# EAGLE schematic KT-744 (EAGLE 6.4)
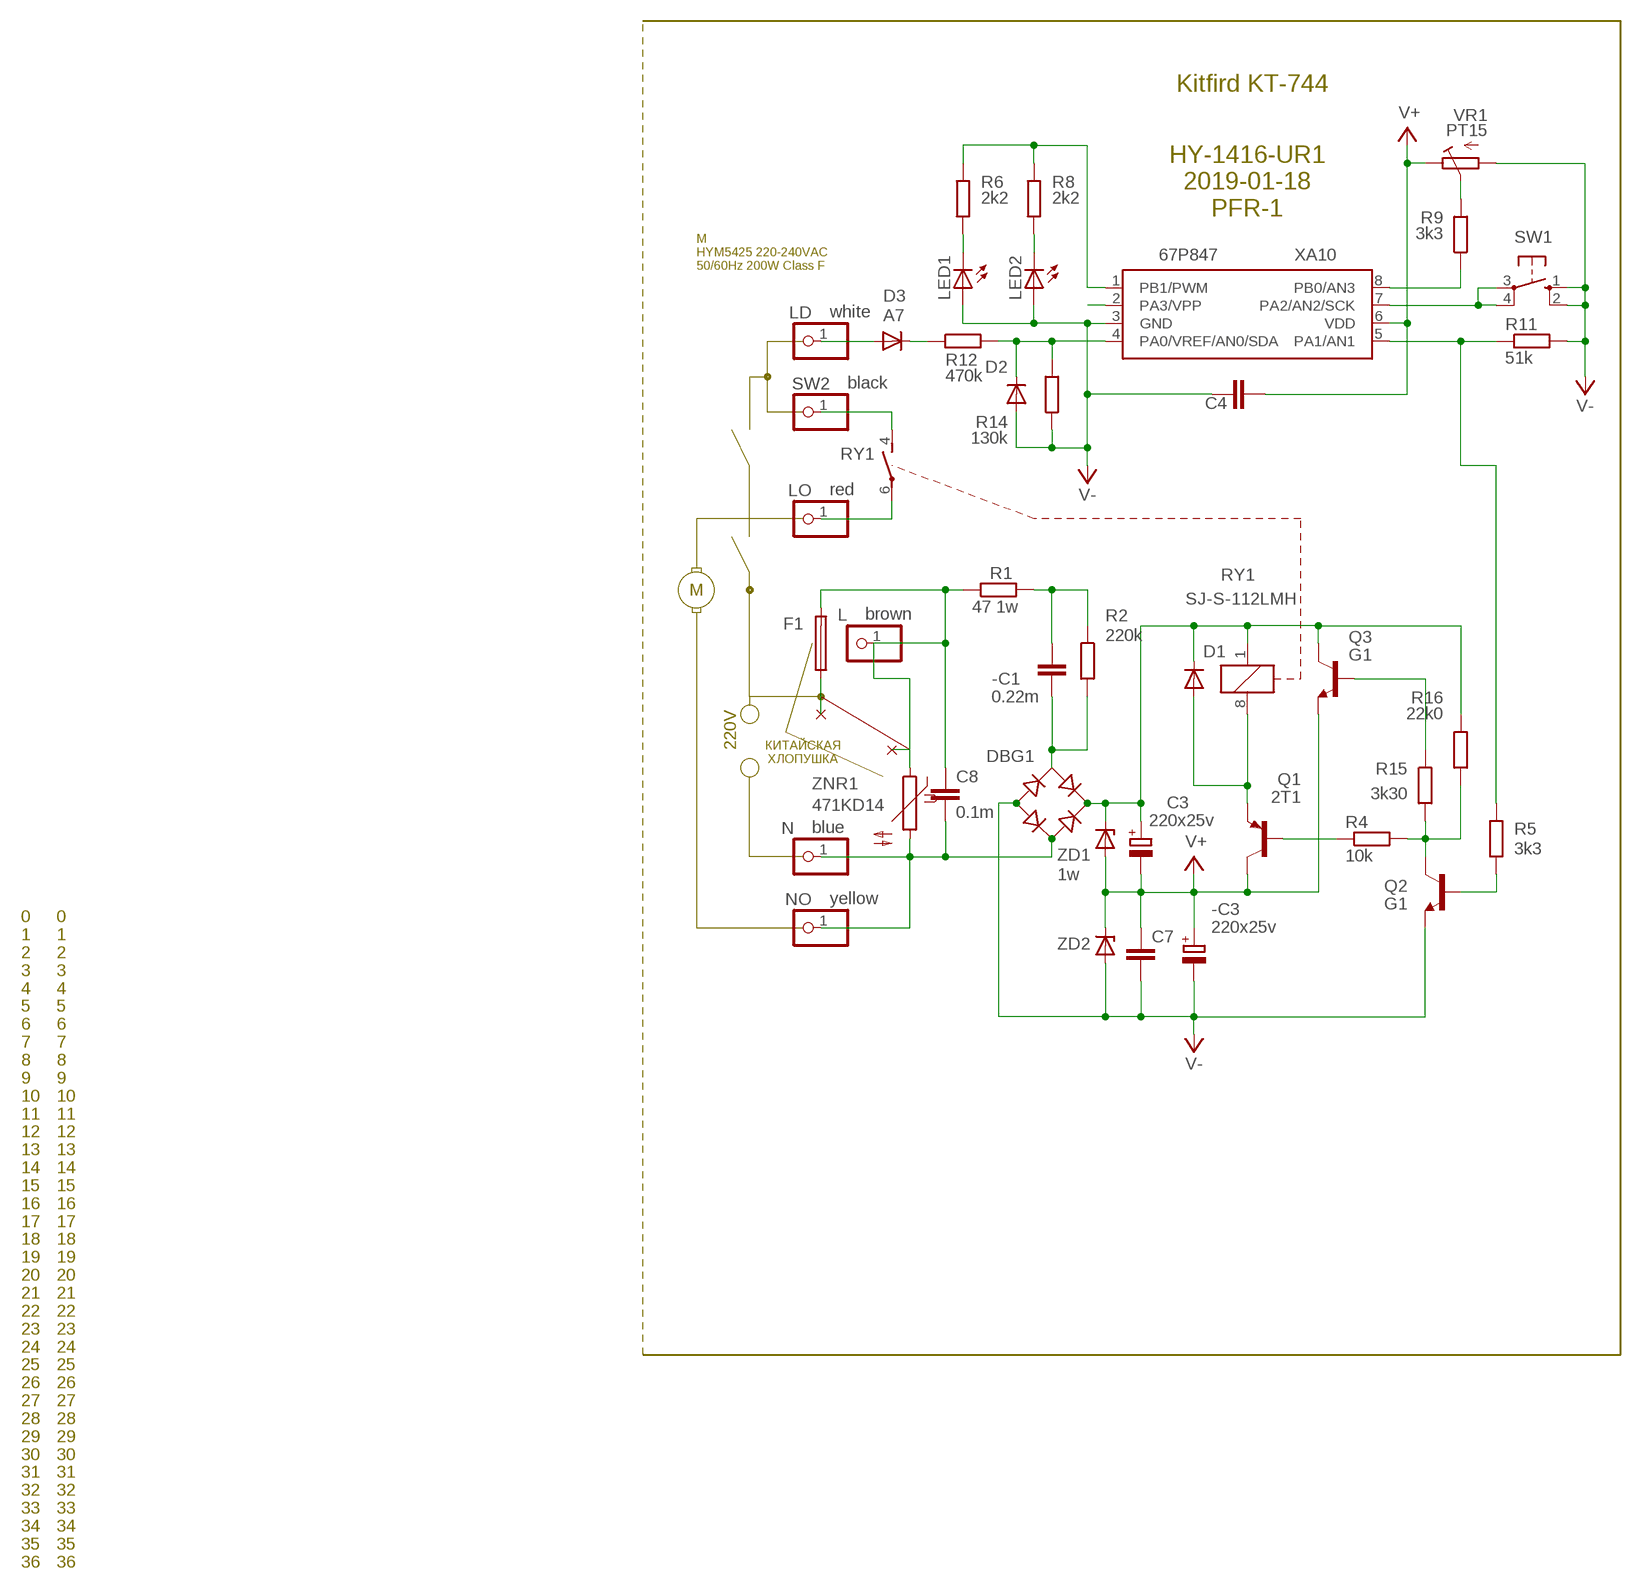
[diagram p0: schematic, sheet 1]

## Parts
67P847  XA10  SH67P847  [SOIC8]
-C1  0.22m  C-EU150-072X183  [C150-072X183]
-C3  220x25v  CPOL-EUE5-10.5  [E5-10,5]
C3  220x25v  CPOL-EUE5-10.5  [E5-10,5]
C4  C-EU150-072X183  [C150-072X183]
C7  C-EU150-072X183  [C150-072X183]
C8  0.1m  C-EU102-064X133  [C102-064X133]
D1  DIODE-SOD80C  [SOD80C]
D2  DIODE-SOD80C  [SOD80C]
D3  A7  DIODE-SOD80C  [SOD80C]
DBG1  B1S  [MBS]
F1  PICOFUSE  [PICOFUSE]
L  brown  PINHD-1X1  [1X01]
LD  white  PINHD-1X1  [1X01]
LED1  LEDSML0805  [SML0805]
LED2  LEDSML0805  [SML0805]
LO  red  PINHD-1X1  [1X01]
N  blue  PINHD-1X1  [1X01]
NO  yellow  PINHD-1X1  [1X01]
Q1  2T1  -PNP-SOT23-EBC  [SOT23-EBC]
Q2  G1  -NPN-SOT23-EBC  [SOT23-EBC]
Q3  G1  -NPN-SOT23-EBC  [SOT23-EBC]
R1  47 1w  R-EU_0414/15  [0414/15]
R2  220k  R-EU_0207/12  [0207/12]
R4  10k  R-EU_M1206  [M1206]
R5  3k3  R-EU_M0805  [M0805]
R6  2k2  R-EU_0207/12  [0207/12]
R8  2k2  R-EU_0207/12  [0207/12]
R9  3k3  R-EU_M0805  [M0805]
R11  51k  R-EU_M0805  [M0805]
R12  470k  R-EU_0207/15  [0207/15]
R14  130k  R-EU_M0805  [M0805]
R15  3k30  R-EU_M1206  [M1206]
R16  22k0  R-EU_M0805  [M0805]
RY1  SJ-S-112LMH  JW1A  [JW1A]
SW1  10-XX  [B3F-10XX]
SW2  black  PINHD-1X1  [1X01]
VR1  PT15  R-TRIMM3339P  [RTRIM3339P]
ZD1  1w  ZENER-DIODEF126-10  [F126Z10]
ZD2  ZENER-DIODEC1702-15  [C1702-15]
ZNR1  471KD14  S07K17  [S07K17]

## Nets
N$1: 67P847.8(PB0/AN3) R9.1
N$2: R9.2 VR1.2(S)
N$3: -C1.2 DBG1.AC1 R2.2
N$4: C8.1 F1.2 L.1 R1.1 ZNR1.1
N$5: -C1.1 R1.2 R2.1
N$6: C8.2 DBG1.AC2 N.1 NO.1 ZNR1.2
N$7: RY1.4(1:S) SW2.1
N$8: C3.+ D1.C DBG1.+ Q3.C R16.1 RY1.1 ZD1.C
N$10: D1.A Q1.E RY1.8
N$11: LO.1 RY1.6(1:P)
N$12: D3.A LD.1
N$13: 67P847.5(PA1/AN1) R5.1 R11.1
N$14: D3.C R12.1
N$15: 67P847.4(PA0/VREF/AN0/SDA) D2.C R12.2 R14.2
N$16: LED1.C R6.1
N$17: 67P847.7(PA2/AN2/SCK) SW1.3(P) SW1.4(P1)
N$18: 67P847.1(PB1/PWM) R6.2 R8.2
N$19: LED2.C R8.1
N$20: 67P847.2(PA3/VPP)
N$21: Q2.B R5.2
N$22: Q1.B R4.1
N$23: F1.1
N$24: Q3.B R15.1
N$26: Q2.C R4.2 R15.2 R16.2
V+: 67P847.6(VDD) -C3.+ C3.- C4.2 C7.1 Q1.C Q3.E VR1.3(E) ZD1.A ZD2.C
V-: 67P847.3(GND) -C3.- C4.1 C7.2 D2.A DBG1.- LED1.A LED2.A Q2.E R11.2 R14.1 SW1.1(S) SW1.2(S1) VR1.1(A) ZD2.A

## Notes on the sheet
- Kitfird KT-744
- HY-1416-UR1
  2019-01-18
  PFR-1
- M
  HYM5425 220-240VAC 
  50/60Hz 200W Class F
- M
- 220V
- КИТАЙСКАЯ
  ХЛОПУШКА
- 0
  1
  2
  3
  4
  5
  6
  7
  8
  9
  10
  11
  12
  13
  14
  15
  16
  17
  18
  19
  20
  21
  22
  23
  24
  25
  26
  27
  28
  29
  30
  31
  32
  33
  34
  35
  36
- 0
  1
  2
  3
  4
  5
  6
  7
  8
  9
  10
  11
  12
  13
  14
  15
  16
  17
  18
  19
  20
  21
  22
  23
  24
  25
  26
  27
  28
  29
  30
  31
  32
  33
  34
  35
  36

## Library data of the parts
67P847 = SINO_WEALTH:SH67P847
-C1 C4 C7 C8 = rcl:C-EU: CAPACITOR, European symbol
-C3 C3 = rcl:CPOL-EU: POLARIZED CAPACITOR, European symbol
D1-D3 = diode:DIODE-: DIODE
DBG1 = rectifier:B*S: Surface Mount Glass Passivated Bridge Rectifiers Source: Comchip Bridge Rectifiers B05S-G_B10S-G.pdf
F1 = fuse:PICOFUSE: PICOFUSE 19275, Wickmann; OC_FARNELL: unknown; OC_NEWARK: unknown
L LD LO N NO SW2 = Разъёмы штырьковые 2.54мм:PINHD-1X1: PIN HEADER
LED1 LED2 = led:LED: LED OSRAM: - CHIPLED LG R971, LG N971, LY N971, LG Q971, LY Q971, LO R971, LY R971 LH N974, LH R974 LS Q976, LO Q976, LY Q976 LO Q996 - Hyper CHIPLED LW Q18S LB Q993, LB Q99A, LB R99A - SideLED LS A670, LO A670, LY A670, LG A670, LP A670 LB A673, LV A673, LT A673, LW A673 LH A674 LY A675 LS A676, LA A676, LO A676, LY A676, LW A676 LS A679, LY A679, LG A679 - Hyper Micro SIDELED® LS Y876, LA Y876, LO Y876, LY Y876 LT Y87S - SmartLED LW L88C, LW L88S LB L89C, LB L89S, LG L890 LS L89K, LO L89K, LY L89K LS L896, LA L896, LO L896, LY L896 - TOPLED LS T670, LO T670, LY T670, LG T670, LP T670 LSG T670, LSP T670, LSY T670, LOP T670, LYG T670 LG T671, LOG T671, LSG T671 LB T673, LV T673, LT T673, LW T673 LH T674 LS T676, LA T676, LO T676, LY T676, LB T676, LH T676, LSB T676, LW T676 LB T67C, LV T67C, LT T67C, LS T67K, LO T67K, LY T67K, LW E67C LS E67B, LA E67B, LO E67B, LY E67B, LB E67C, LV E67C, LT E67C LW T67C LS T679, LY T679, LG T679 LS T770, LO T770, LY T770, LG T770, LP T770 LB T773, LV T773, LT T773, LW T773 LH T774 LS E675, LA E675, LY E675, LS T675 LS T776, LA T776, LO T776, LY T776, LB T776 LHGB T686 LT T68C, LB T68C - Hyper Mini TOPLED® LB M676 - Mini TOPLED Santana® LG M470 LS M47K, LO M47K, LY M47K Source: http://www.osram.convergy.de LUXEON: - LUMILED® LXK2-PW12-R00, LXK2-PW12-S00, LXK2-PW14-U00, LXK2-PW14-V00 LXK2-PM12-R00, LXK2-PM12-S00, LXK2-PM14-U00 LXK2-PE12-Q00, LXK2-PE12-R00, LXK2-PE12-S00, LXK2-PE14-T00, LXK2-PE14-U00 LXK2-PB12-K00, LXK2-PB12-L00, LXK2-PB12-M00, LXK2-PB14-N00, LXK2-PB14-P00, LXK2-PB14-Q00 LXK2-PR12-L00, LXK2-PR12-M00, LXK2-PR14-Q00, LXK2-PR14-R00 LXK2-PD12-Q00, LXK2-PD12-R00, LXK2-PD12-S00 LXK2-PH12-R00, LXK2-PH12-S00 LXK2-PL12-P00, LXK2-PL12-Q00, LXK2-PL12-R00 Source: www.luxeon.com KINGBRIGHT: KA-3528ASYC Source: www.kingbright.com
Q1 = transistor:*-PNP-: PNP Transistror
Q2 Q3 = transistor:*-NPN-: NPN Transistror BF959 corrected 2008.03.06
R1 R2 R4-R6 R8 R9 R11 R12 R14-R16 = rcl:R-EU_: RESISTOR, European symbol
RY1 = relay:JW1A: Power relay Source: Panasonic Electric Works Co., Ltd. / jw.catalog.pdf
SW1 = switch-omron:10-XX: OMRON SWITCH; MPN: B3F-1000; OC_FARNELL: 176432; OC_NEWARK: 36M3542
VR1 = rcl:R-TRIMM: Trimm resistor
ZD1 ZD2 = diode:ZENER-DIODE: Z-Diode
ZNR1 = varistor:S07K17: VARISTOR